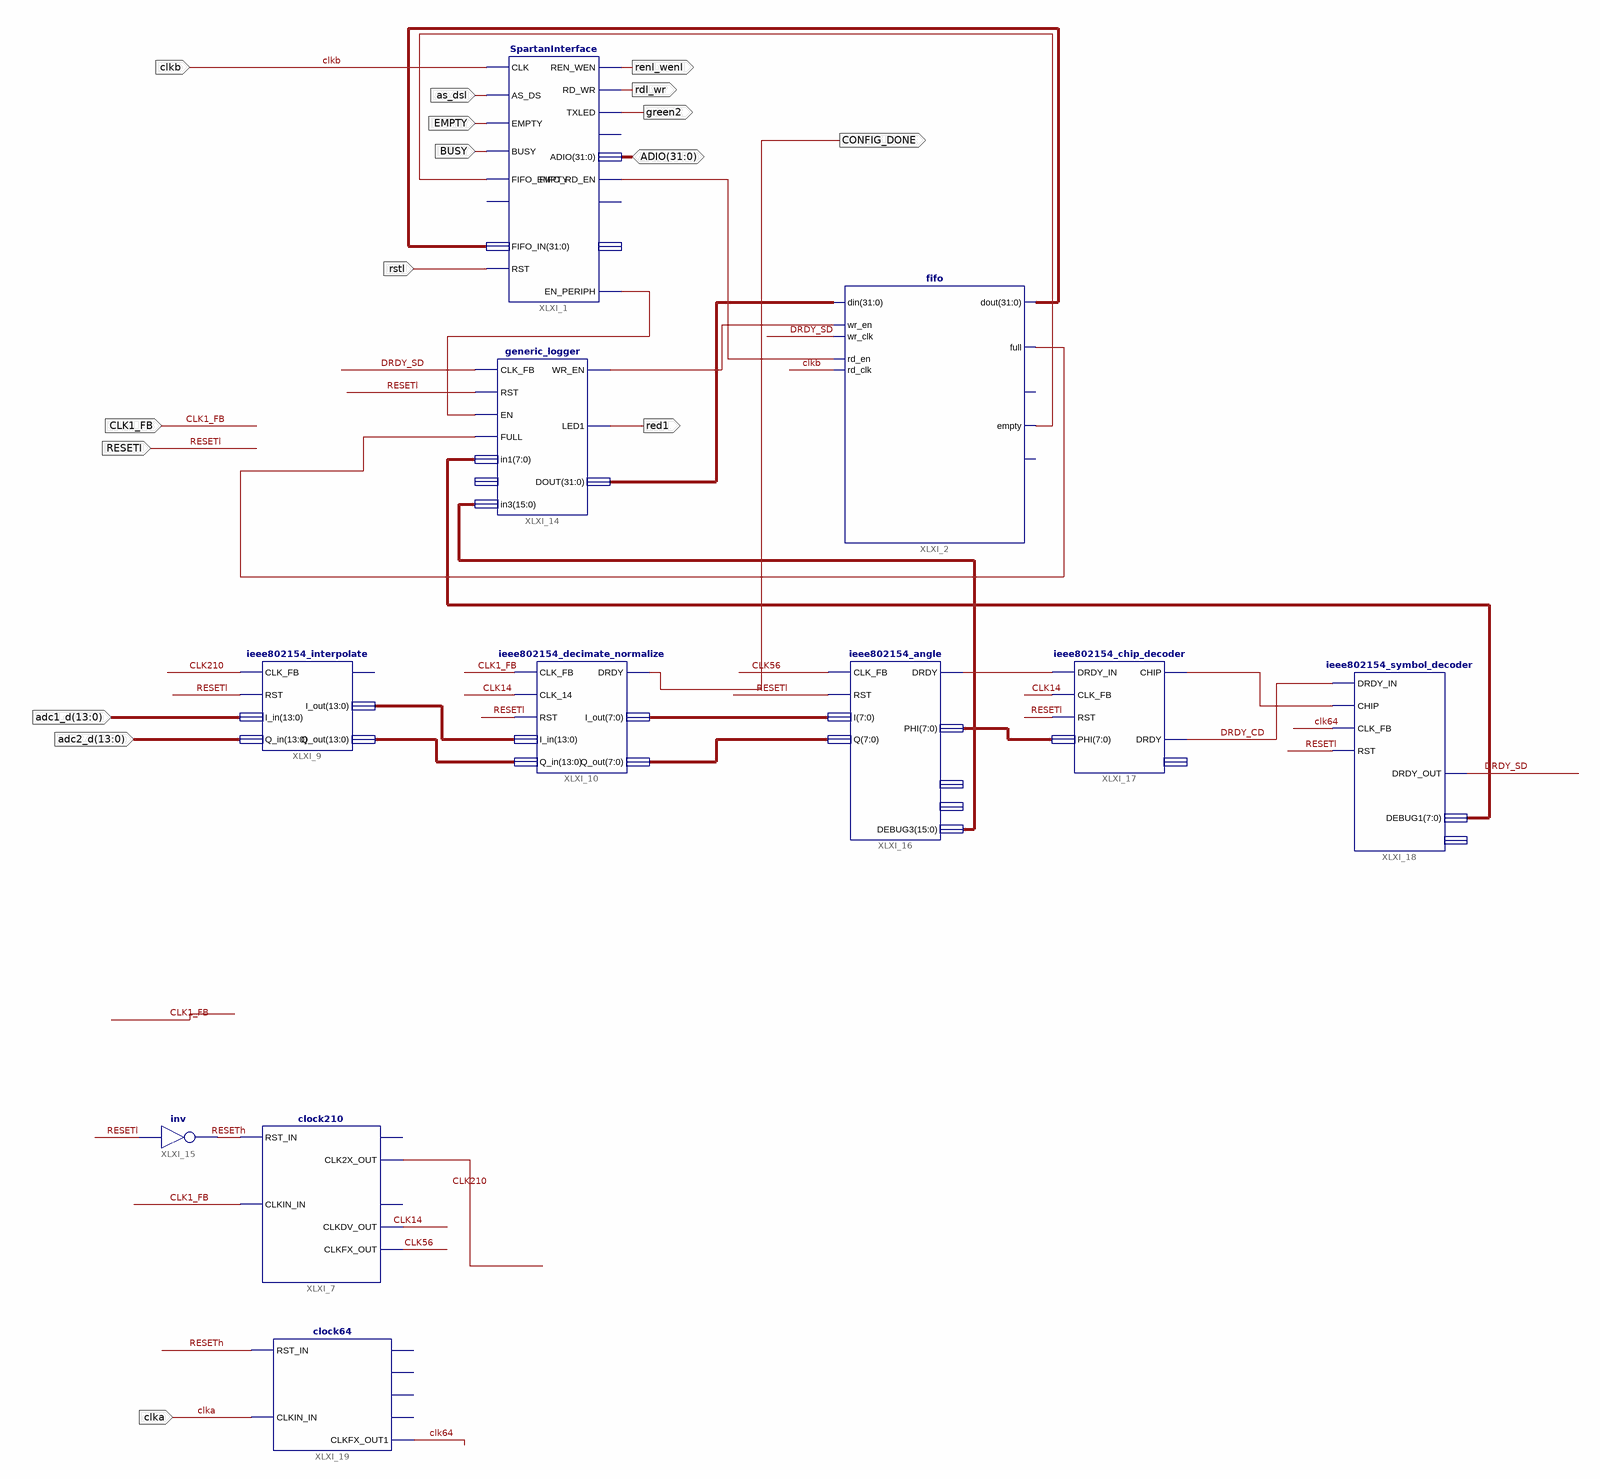
[diagram p0: schematic sheet 1]
// Xilinx ISE schematic Main.sch (virtex4) as structural Verilog: 11 symbols, 17 ports
module Main (
  input  as_dsl,
  input  EMPTY,
  input  BUSY,
  input  clkb,
  input  rstl,
  input  CLK1_FB,
  input  [13:0] adc1_d,
  input  [13:0] adc2_d,
  input  RESETl,
  input  clka,
  inout  [31:0] ADIO,
  output renl_wenl,
  output rdl_wr,
  output green2,
  output CLK14,
  output red1,
  output CONFIG_DONE
);

  wire CLK56, clk64, CLK210, DRDY_CD, DRDY_SD, RESETh, XLXN_1, XLXN_3, XLXN_7, XLXN_74, XLXN_75, XLXN_103,
       XLXN_106;
  wire [7:0] XLXN_83, XLXN_95, XLXN_102, XLXN_109;
  wire [13:0] XLXN_56, XLXN_57;
  wire [15:0] XLXN_98;
  wire [31:0] dout, XLXN_76;

  SpartanInterface XLXI_1 (
    .RST(rstl), .CLK(clkb), .AS_DS(as_dsl), .EMPTY(EMPTY), .BUSY(BUSY), .FIFO_EMPTY(XLXN_1), .FIFO_IN(dout),
    .ADIO(ADIO), .REN_WEN(renl_wenl), .RD_WR(rdl_wr), .TXLED(green2), .FIFO_RD_EN(XLXN_3), .EN_PERIPH(XLXN_74));  // open: FIFO_FULL, RXLED, FIFO_WR_EN, FIFO_OUT
  fifo XLXI_2 (
    .din(XLXN_76), .wr_en(XLXN_75), .wr_clk(DRDY_SD), .rd_en(XLXN_3), .rd_clk(clkb), .dout(dout),
    .full(XLXN_7), .empty(XLXN_1));  // open: overflow, valid
  clock210 XLXI_7 (
    .CLKIN_IN(CLK1_FB), .RST_IN(RESETh), .CLK2X_OUT(CLK210), .CLKDV_OUT(CLK14), .CLKFX_OUT(CLK56));  // open: LOCKED_OUT, CLK0_OUT
  ieee802154_interpolate XLXI_9 (
    .CLK_FB(CLK210), .RST(RESETl), .I_in(adc1_d), .Q_in(adc2_d), .I_out(XLXN_56), .Q_out(XLXN_57));  // open: DRDY
  ieee802154_decimate_normalize XLXI_10 (
    .CLK_FB(CLK1_FB), .CLK_14(CLK14), .RST(RESETl), .I_in(XLXN_56), .Q_in(XLXN_57), .DRDY(CONFIG_DONE),
    .I_out(XLXN_95), .Q_out(XLXN_83));
  generic_logger XLXI_14 (
    .CLK_FB(DRDY_SD), .RST(RESETl), .EN(XLXN_74), .FULL(XLXN_7), .in1(XLXN_109), .WR_EN(XLXN_75),
    .LED1(red1), .DOUT(XLXN_76), .in3(XLXN_98));  // open: in2
  not XLXI_15 (RESETh, RESETl);
  ieee802154_angle XLXI_16 (
    .CLK_FB(CLK56), .RST(RESETl), .I(XLXN_95), .Q(XLXN_83), .DRDY(XLXN_103), .PHI(XLXN_102), .DEBUG3(XLXN_98));  // open: DEBUG1, DEBUG2
  ieee802154_chip_decoder XLXI_17 (
    .DRDY_IN(XLXN_103), .CLK_FB(CLK14), .RST(RESETl), .PHI(XLXN_102), .CHIP(XLXN_106), .DRDY(DRDY_CD));  // open: DEBUG1
  ieee802154_symbol_decoder XLXI_18 (
    .DRDY_IN(DRDY_CD), .CHIP(XLXN_106), .CLK_FB(clk64), .RST(RESETl), .DRDY_OUT(DRDY_SD), .DEBUG1(XLXN_109));  // open: SYMBOL
  clock64 XLXI_19 (
    .RST_IN(RESETh), .CLKIN_IN(clka), .CLKFX_OUT1(clk64));  // open: LOCKED_OUT, CLKFX_OUT, CLKIN_IBUFG_OUT, CLK0_OUT
endmodule
